# EAGLE schematic transmiter (EAGLE 8.7.0)
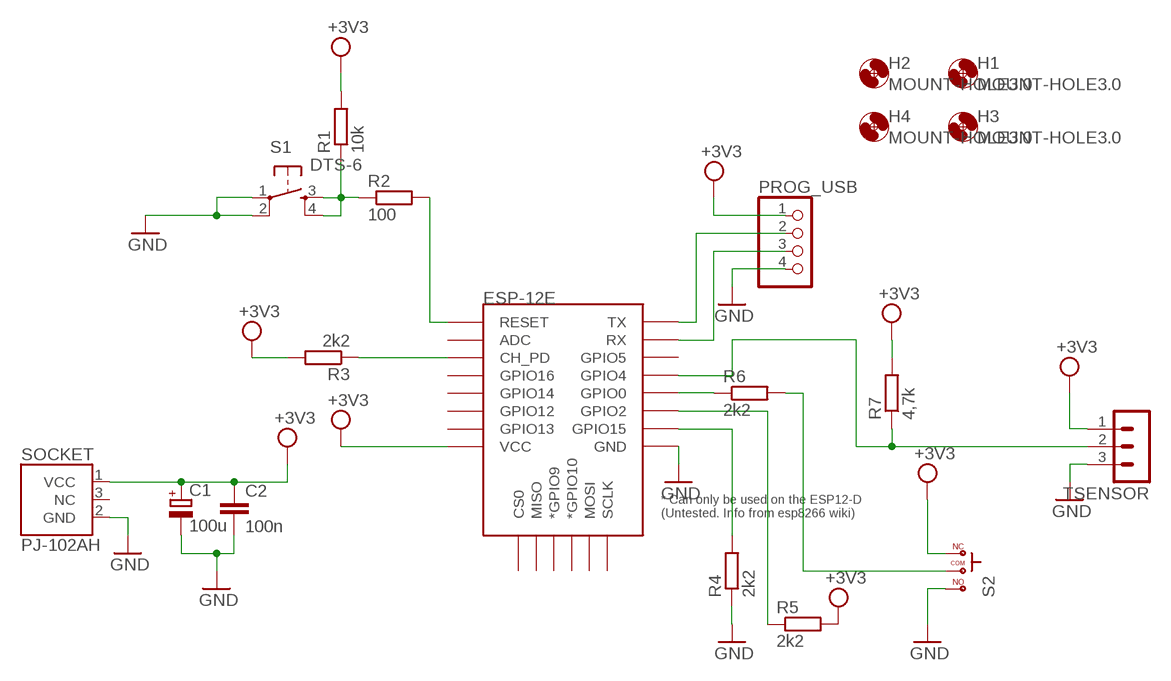
[diagram p0: schematic, sheet 1]

## Parts
C1  100u  CPOL-EUE2.5-6  [E2,5-6]
C2  100n  C-EU025-025X050  [C025-025X050]
ESP-12E  ESP12ESMD  [ESP12E-SMD]
H1  MOUNT-HOLE3.0  [3,0]
H2  MOUNT-HOLE3.0  [3,0]
H3  MOUNT-HOLE3.0  [3,0]
H4  MOUNT-HOLE3.0  [3,0]
PROG_USB  PINHD-1X4  [1X04]
R1  10k  R-EU_0204/7  [0204/7]
R2  100  R-EU_0204/7  [0204/7]
R3  2k2  R-EU_0204/7  [0204/7]
R4  2k2  R-EU_0204/7  [0204/7]
R5  2k2  R-EU_0204/7  [0204/7]
R6  2k2  R-EU_0204/7  [0204/7]
R7  4,7k  R-EU_0204/7  [0204/7]
S1  DTS-6  [DTS-6]
S2  -SWITCH  [CON3]
SOCKET  PJ-102AH  [PJ-102AH]
TSENSOR  MA03-1  [MA03-1]

## Nets
GND: C1.- C2.2 ESP-12E.GND PROG_USB.4 R4.1 S1.1 S1.2 S2.P$3 SOCKET.2(GND) TSENSOR.3
N$1: ESP-12E.GPIO2 R5.1
N$2: ESP-12E.CH_PD R3.1
N$3: ESP-12E.TXD0(TX) PROG_USB.2
N$4: ESP-12E.RXD0(RX) PROG_USB.3
N$5: ESP-12E.GPIO4 R7.1 TSENSOR.2
N$6: R6.2 S2.P$2
N$7: ESP-12E.GPIO15 R4.2
N$8: ESP-12E.RESET R2.2
N$9: R1.1 R2.1 S1.3 S1.4
N$10: ESP-12E.GPIO0 R6.1
VCC: C1.+ C2.1 ESP-12E.VCC PROG_USB.1 R1.2 R3.2 R5.2 R7.2 S2.P$1 SOCKET.1(VCC) TSENSOR.1 ; supply symbol labelled +3V3
Unconnected: ESP-12E.ADC ESP-12E.CS0 ESP-12E.GPIO5 ESP-12E.GPIO9(*GPIO9) ESP-12E.GPIO10(*GPIO10) ESP-12E.GPIO12 ESP-12E.GPIO13 ESP-12E.GPIO14 ESP-12E.GPIO16 ESP-12E.MISO ESP-12E.MOSI ESP-12E.SCLK SOCKET.3(NC)

## Library data of the parts
C1 = rcl:CPOL-EU: POLARIZED CAPACITOR, European symbol; SPICEPREFIX: C
C2 = rcl:C-EU: CAPACITOR, European symbol; SPICEPREFIX: C
ESP-12E = esp8266modules:ESP12E: ESP12E Module
H1-H4 = holes:MOUNT-HOLE: MOUNTING HOLE with drill center marker
PROG_USB = pinhead:PINHD-1X4: PIN HEADER
R1-R7 = rcl:R-EU_: RESISTOR, European symbol; SPICEPREFIX: R
S1 = switch-tact:DTS-6
S2 = tango:-SWITCH
SOCKET = connector:PJ-102AH: DC Power Jack 2.0mm / 5.5mm; DIGIKEY: CP-102AH-ND
TSENSOR = con-lstb:MA03-1: PIN HEADER; OC_FARNELL: unknown; OC_NEWARK: unknown

## Net classes
0 default: clearance 0.205 mm